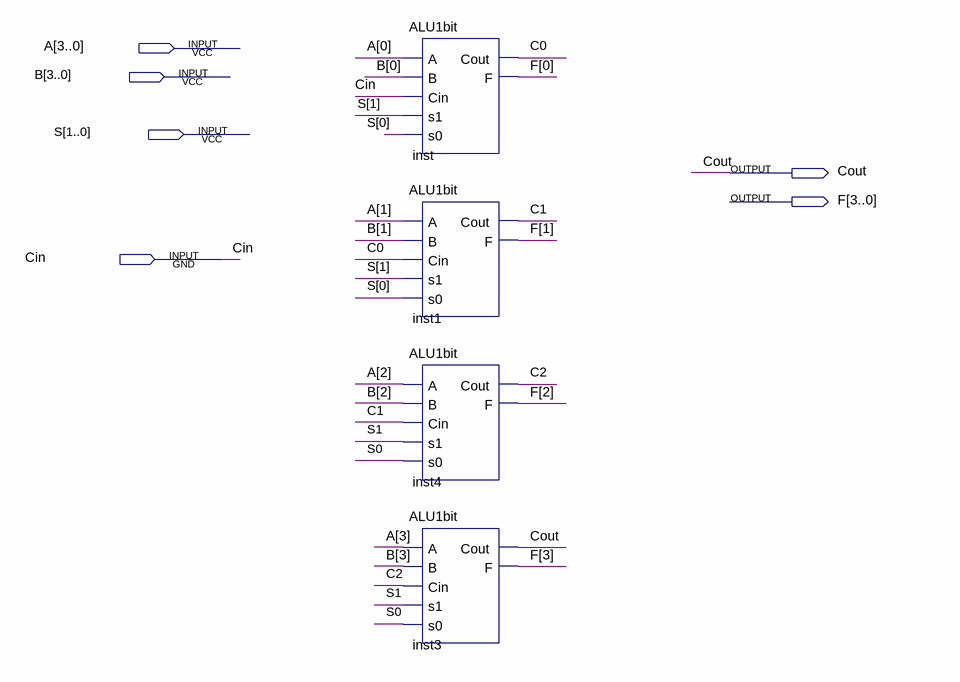
[diagram p0: schematic sheet]
// Quartus schematic ALU4BIT.bdf as structural Verilog: 4 symbols, 6 pins
module ALU4BIT (
  input  [3:0] A,
  input  [3:0] B,
  input  [1:0] S,
  input  Cin,
  output Cout,
  output [3:0] F
);

  wire C0, C1, C2;

  ALU1bit inst (.A(A[0]), .B(B[0]), .Cin(Cin), .s1(S[1]), .s0(S[0]), .Cout(C0), .F(F[0]));
  ALU1bit inst1 (.A(A[1]), .B(B[1]), .Cin(C0), .s1(S[1]), .s0(S[0]), .Cout(C1), .F(F[1]));
  ALU1bit inst4 (.A(A[2]), .B(B[2]), .Cin(C1), .s1(S[1]), .s0(S[0]), .Cout(C2), .F(F[2]));
  ALU1bit inst3 (.A(A[3]), .B(B[3]), .Cin(C2), .s1(S[1]), .s0(S[0]), .Cout(Cout), .F(F[3]));
endmodule
